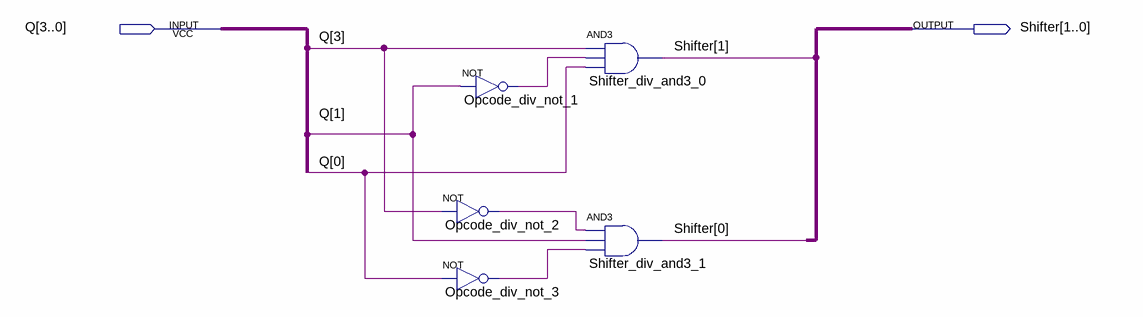
[diagram p0: schematic sheet]
// Quartus schematic Shifter_Division.bdf as structural Verilog: 5 symbols, 2 pins
module Shifter_Division (
  input  [3:0] Q,
  output [1:0] Shifter
);

  wire Opcode_div_not_1_out, Opcode_div_not_2_out, Opcode_div_not_3_out;

  not Opcode_div_not_1 (Opcode_div_not_1_out, Q[1]);
  not Opcode_div_not_2 (Opcode_div_not_2_out, Q[3]);
  not Opcode_div_not_3 (Opcode_div_not_3_out, Q[0]);
  and Shifter_div_and3_0 (Shifter[1], Q[3], Opcode_div_not_1_out, Q[0]);
  and Shifter_div_and3_1 (Shifter[0], Opcode_div_not_2_out, Q[1], Opcode_div_not_3_out);
endmodule
